# Altium schematic sheet [2] BLOCK DIAGRAM.SchDoc: Block diagram
size A4; CompanyName: RADWAG Wagi Elektroniczne; Organization: RADWAG Wagi Elektroniczne; Address1: ul. Bracka 28; Address2: 26-600 RADOM; Address3: POLAND; SheetNumber: 2; SheetTotal: 6
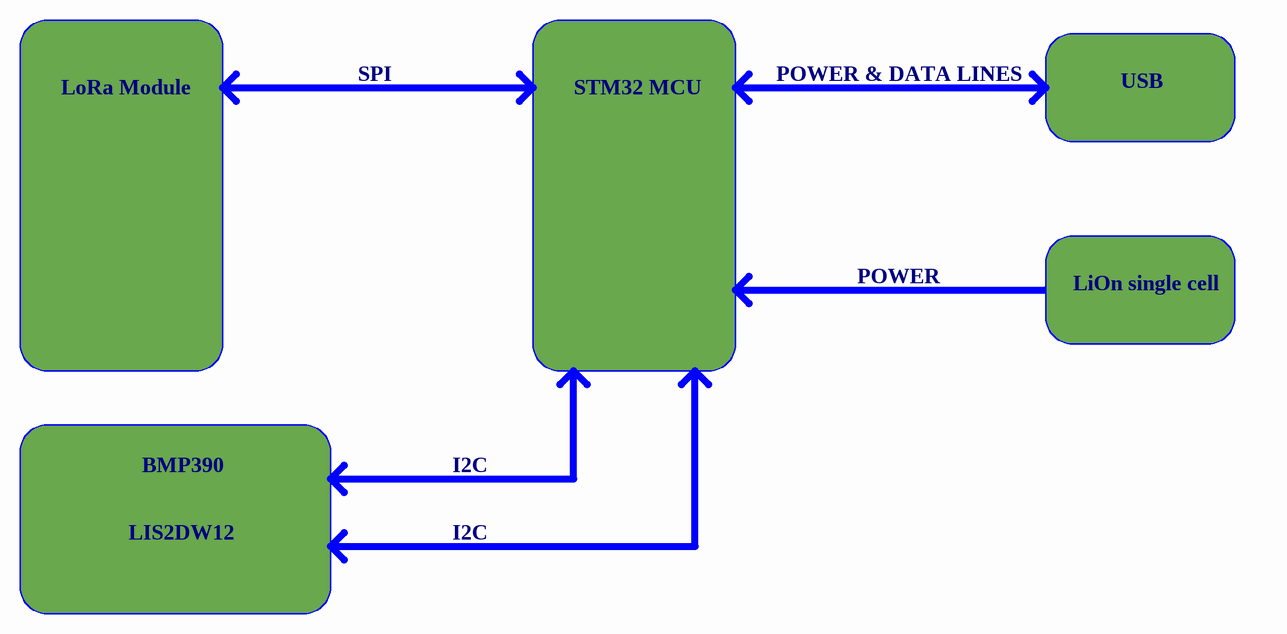
[diagram p0: [2] BLOCK DIAGRAM.SchDoc]

## Notes on the sheet
- LoRa Module
- SPI
- STM32 MCU
- POWER & DATA LINES
- USB
- POWER
- LiOn single cell
- BMP390
- I2C
- LIS2DW12
- Title:
- Size: A4
- Page contents:
- Date:
- Version:
- Drawn by:
- Issue:
- Sheet number:
- of